# Altium project EDR_LIPO.PrjPcb
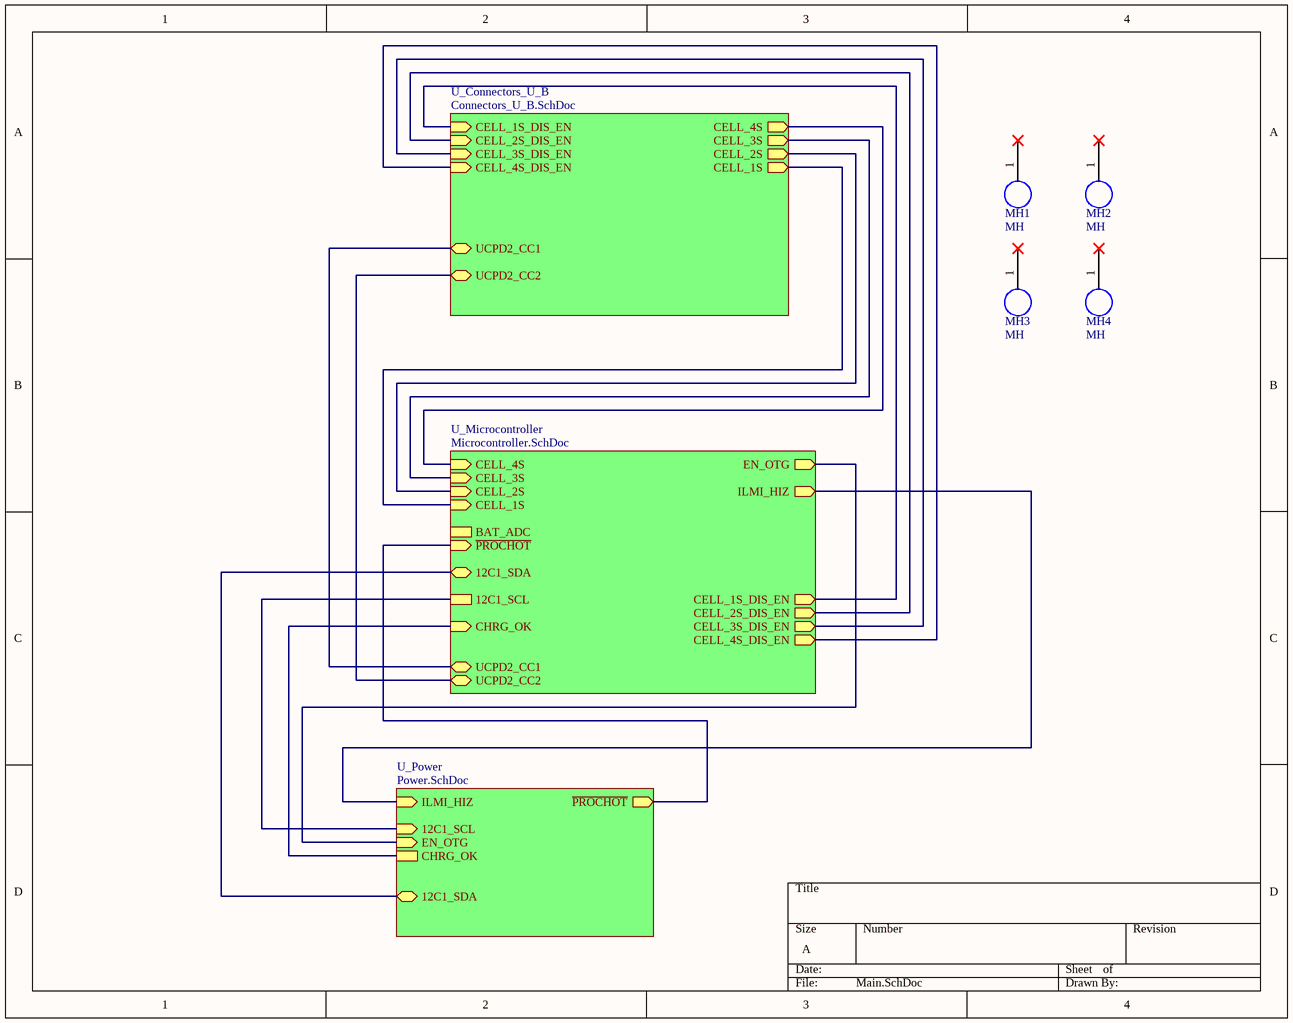
[diagram p0: Main.SchDoc]
2 sheets, 70 parts. Net scope: hierarchical (ports join the sheet entries above them; power ports are global).
Board file: Main_conection.PcbDoc
Sheets:
  Main.SchDoc
    U_Microcontroller = Microcontroller.SchDoc

## Sheet Main.SchDoc
size A; SheetNumber: 1; SheetTotal: 4

### Parts
MH1  MH  [MH]
MH2  MH  [MH]
MH3  MH  [MH]
MH4  MH  [MH]

### Sub-sheets
U_Connectors_U_B = Connectors_U_B.SchDoc (file not in this document): CELL_4S (out), CELL_3S (out), CELL_2S (out), CELL_1S (out), CELL_1S_DIS_EN (in), CELL_2S_DIS_EN (in), CELL_3S_DIS_EN (in), CELL_4S_DIS_EN (in), UCPD2_CC1 (bidir), UCPD2_CC2 (bidir)
U_Microcontroller = Microcontroller.SchDoc: BAT_ADC, CELL_4S (in), CELL_3S (in), CELL_2S (in), CELL_1S (in), EN_OTG (out), ~{PROCHOT} (in), CELL_3S_DIS_EN (out), CELL_4S_DIS_EN (out), ILMI_HIZ (out), CELL_2S_DIS_EN (out), CELL_1S_DIS_EN (out), 12C1_SDA (bidir), 12C1_SCL, CHRG_OK (in), UCPD2_CC1 (bidir), UCPD2_CC2 (bidir)
U_Power = Power.SchDoc (file not in this document): ILMI_HIZ (in), ~{PROCHOT} (out), 12C1_SDA (bidir), 12C1_SCL (in), EN_OTG (in), CHRG_OK

### Nets
12C1_SCL: sheet U_Microcontroller/12C1_SCL, sheet U_Power/12C1_SCL
12C1_SDA: sheet U_Microcontroller/12C1_SDA, sheet U_Power/12C1_SDA
CELL_1S_DIS_EN: sheet U_Connectors_U_B/CELL_1S_DIS_EN, sheet U_Microcontroller/CELL_1S_DIS_EN
CELL_2S_DIS_EN: sheet U_Connectors_U_B/CELL_2S_DIS_EN, sheet U_Microcontroller/CELL_2S_DIS_EN
CELL_3S_DIS_EN: sheet U_Connectors_U_B/CELL_3S_DIS_EN, sheet U_Microcontroller/CELL_3S_DIS_EN
CELL_4S_DIS_EN: sheet U_Connectors_U_B/CELL_4S_DIS_EN, sheet U_Microcontroller/CELL_4S_DIS_EN
UCPD2_CC1: sheet U_Connectors_U_B/UCPD2_CC1, sheet U_Microcontroller/UCPD2_CC1
UCPD2_CC2: sheet U_Connectors_U_B/UCPD2_CC2, sheet U_Microcontroller/UCPD2_CC2
NetR36_2: sheet U_Connectors_U_B/CELL_4S, sheet U_Microcontroller/CELL_4S
NetR37_2: sheet U_Connectors_U_B/CELL_2S, sheet U_Microcontroller/CELL_2S
NetR38_2: sheet U_Connectors_U_B/CELL_3S, sheet U_Microcontroller/CELL_3S
NetR39_2: sheet U_Connectors_U_B/CELL_1S, sheet U_Microcontroller/CELL_1S
NetU3_19: sheet U_Microcontroller/EN_OTG, sheet U_Power/EN_OTG
NetU3_20: sheet U_Microcontroller/~{PROCHOT}, sheet U_Power/~{PROCHOT}
NetU3_23: sheet U_Microcontroller/ILMI_HIZ, sheet U_Power/ILMI_HIZ
NetU3_24: sheet U_Microcontroller/CHRG_OK, sheet U_Power/CHRG_OK

Not connected (* = marked no-connect by the designer): MH1 1*; MH2 1*; MH3 1*; MH4 1*

## Sheet Microcontroller.SchDoc
size A; SheetNumber: 4; SheetTotal: 4
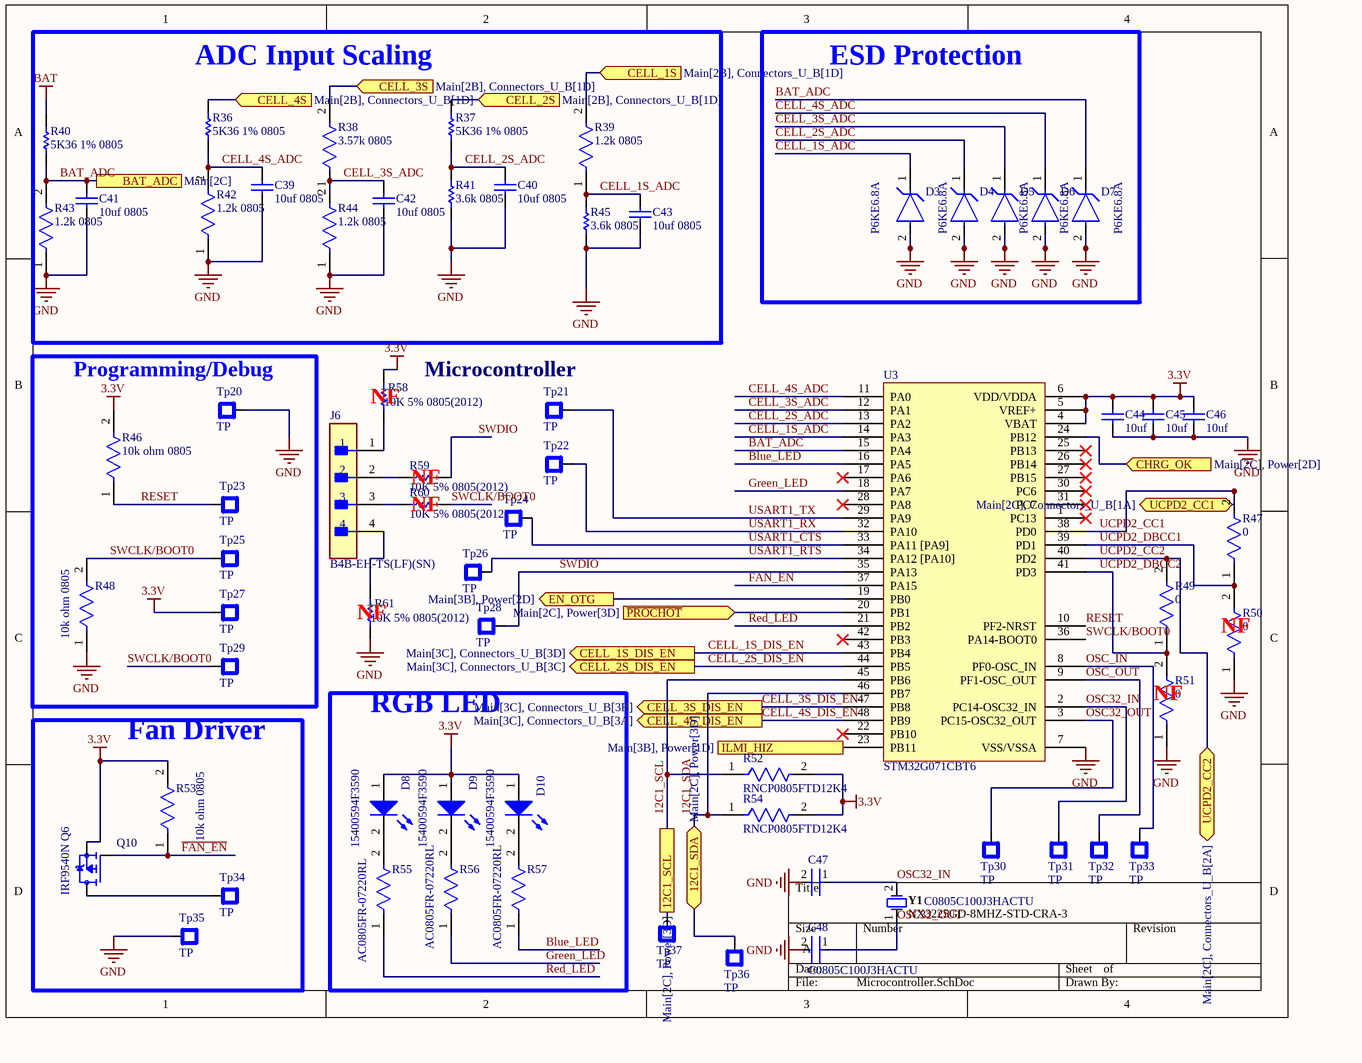
[diagram p1: Microcontroller.SchDoc]

### Parts
C39  10uf 0805  [CAPC2013X145X50NL20T20]
C40  10uf 0805  [CAPC2013X145X50NL20T20]
C41  10uf 0805  [CAPC2013X145X50NL20T20]
C42  10uf 0805  [CAPC2013X145X50NL20T20]
C43  10uf 0805  [CAPC2013X145X50NL20T20]
C44  10uf  [CAPC2013X145X50LL20T25]
C45  10uf  [CAPC2013X145X50LL20T25]
C46  10uf  [CAPC2013X145X50LL20T25]
C47  C0805C100J3HACTU  [FP-C0805C-DN-MFG]
C48  C0805C100J3HACTU  [FP-C0805C-DN-MFG]
D3  P6KE6.8A  [FP-P6KE-MFG]
D4  P6KE6.8A  [FP-P6KE-MFG]
D5  P6KE6.8A  [FP-P6KE-MFG]
D6  P6KE6.8A  [FP-P6KE-MFG]
D7  P6KE6.8A  [FP-P6KE-MFG]
D8  15400594F3590  [WL-TIRC_5mm]
D9  15400594F3590  [WL-TIRC_5mm]
D10  15400594F3590  [WL-TIRC_5mm]
J6  B4B-EH-TS(LF)(SN)  [FP-B4B-EH-TS_LF_SN-MFG]
Q10  IRF9540N Q6  [TO254P1041X444X1930-3]
R36  5K36 1% 0805  [RESC0805(2012)_M]
R37  5K36 1% 0805  [RESC0805(2012)_M]
R38  3.57k 0805  [FP-RT0805-MFG]
R39  1.2k 0805  [FP-RMCF0805-IPC_A]
R40  5K36 1% 0805  [RESC0805(2012)_M]
R41  3.6k 0805  [RESC0805(2012)_L]
R42  1.2k 0805  [FP-RMCF0805-IPC_A]
R43  1.2k 0805  [FP-RMCF0805-IPC_A]
R44  1.2k 0805  [FP-RMCF0805-IPC_A]
R45  3.6k 0805  [RESC0805(2012)_L]
R46  10k ohm 0805  [FP-MCU0805-IPC_C]
R47  0  [FP-HCJ0805-MFG]
R48  10k ohm 0805  [FP-MCU0805-IPC_C]
R49  0  [FP-HCJ0805-MFG]
R50  0  [FP-HCJ0805-MFG]
R51  0  [FP-HCJ0805-MFG]
R52  RNCP0805FTD12K4  [FP-RNCP0805-IPC_C]
R53  10k ohm 0805  [FP-MCU0805-IPC_C]
R54  RNCP0805FTD12K4  [FP-RNCP0805-IPC_C]
R55  AC0805FR-07220RL  [FP-AC0805-MFG]
R56  AC0805FR-07220RL  [FP-AC0805-MFG]
R57  AC0805FR-07220RL  [FP-AC0805-MFG]
R58  10K 5% 0805(2012)  [RESC0805(2012)_L]
R59  10K 5% 0805(2012)  [RESC0805(2012)_L]
R60  10K 5% 0805(2012)  [RESC0805(2012)_L]
R61  10K 5% 0805(2012)  [RESC0805(2012)_L]
Tp20  TP  [Tp]
Tp21  TP  [Tp]
Tp22  TP  [Tp]
Tp23  TP  [Tp]
Tp24  TP  [Tp]
Tp25  TP  [Tp]
Tp26  TP  [Tp]
Tp27  TP  [Tp]
Tp28  TP  [Tp]
Tp29  TP  [Tp]
Tp30  TP  [Tp]
Tp31  TP  [Tp]
Tp32  TP  [Tp]
Tp33  TP  [Tp]
Tp34  TP  [Tp]
Tp35  TP  [Tp]
Tp36  TP  [Tp]
Tp37  TP  [Tp]
U3  STM32G071CBT6  [QFP50P900X900X160-48N]
Y1  NX3225GD-8MHZ-STD-CRA-3  [NDK-NX3225GD-8MHZ-STD-CRA-3_V]

### Blocks framed on the sheet
ADC Input Scaling: C39-C43 R36-R45
ESD Protection: D3-D7
Programming/Debug: R46 R48 Tp20 Tp23 Tp25 Tp27 Tp29
Fan Driver: Q10 R53 Tp34 Tp35
RGB LED: D8-D10 R55-R57

### Ports
12C1_SCL (see Main[2C], Power[3D]), 12C1_SDA (bidir, see Main[2C], Power[3D]), BAT_ADC (see Main[2C]), CELL_1S (in, see Main[2B], Connectors_U_B[1D]), CELL_1S_DIS_EN (out, see Main[3C], Connectors_U_B[3D]), CELL_2S (in, see Main[2B], Connectors_U_B[1D]), CELL_2S_DIS_EN (out, see Main[3C], Connectors_U_B[3C]), CELL_3S (in, see Main[2B], Connectors_U_B[1D]), CELL_3S_DIS_EN (out, see Main[3C], Connectors_U_B[3B]), CELL_4S (in, see Main[2B], Connectors_U_B[1D]), CELL_4S_DIS_EN (out, see Main[3C], Connectors_U_B[3A]), CHRG_OK (in, see Main[2C], Power[2D]), EN_OTG (out, see Main[3B], Power[2D]), ILMI_HIZ (out, see Main[3B], Power[1D]), UCPD2_CC1 (bidir, see Main[2C], Connectors_U_B[1A]), UCPD2_CC2 (bidir, see Main[2C], Connectors_U_B[2A]), ~{PROCHOT} (in, see Main[2C], Power[3D])

### Nets
3.3V: C44.2 C45.2 C46.2 D8.1(A) D9.1(A) D10.1(A) Q10.3(S) R46.2 R52.2 R53.2 R54.2 R58.2 Tp27.1 U3.4(VBAT) U3.5(VREF+) U3.6(VDD/VDDA)
BAT: R40.2
GND: C39.1 C40.1 C41.1 C42.1 C43.1 C44.1 C45.1 C46.1 C47.2 C48.2 D3.2(A) D4.2(A) D5.2(A) D6.2(A) D7.2(A) R41.1 R42.1 R43.1 R44.1 R45.1 R48.1 R50.1 R51.1 R61.1 Tp20.1 Tp35.1 U3.7(VSS/VSSA)
12C1_SCL: R52.1 Tp37.1 U3.45(PB6) ; port 12C1_SCL
12C1_SDA: R54.1 Tp36.1 U3.46(PB7) ; port 12C1_SDA
BAT_ADC: C41.2 D7.1(C) R40.1 R43.2 U3.15(PA4) ; port BAT_ADC
Blue_LED: R57.1 U3.16(PA5)
CELL_1S_ADC: C43.2 D3.1(C) R39.1 R45.2 U3.14(PA3)
CELL_1S_DIS_EN: U3.43(PB4) ; port CELL_1S_DIS_EN
CELL_2S_ADC: C40.2 D4.1(C) R37.1 R41.2 U3.13(PA2)
CELL_2S_DIS_EN: U3.44(PB5) ; port CELL_2S_DIS_EN
CELL_3S_ADC: C42.2 D5.1(C) R38.1 R44.2 U3.12(PA1)
CELL_3S_DIS_EN: U3.47(PB8) ; port CELL_3S_DIS_EN
CELL_4S_ADC: C39.2 D6.1(C) R36.1 R42.2 U3.11(PA0)
CELL_4S_DIS_EN: U3.48(PB9) ; port CELL_4S_DIS_EN
~{FAN_EN}: Q10.1(G) R53.1 U3.37(PA15)
Green_LED: R56.1 U3.18(PA7)
OSC32_IN: C47.1 Tp31.1 U3.2(PC14-OSC32_IN) Y1.2
OSC32_OUT: C48.1 Tp30.1 U3.3(PC15-OSC32_OUT) Y1.1
OSC_IN: Tp33.1 U3.8(PF0-OSC_IN)
OSC_OUT: Tp32.1 U3.9(PF1-OSC_OUT)
Red_LED: R55.1 U3.21(PB2)
RESET: R46.1 Tp23.1 U3.10(PF2-NRST)
SWCLK/BOOT0: R48.2 R60.2 Tp25.1 Tp29.1 U3.36(PA14-BOOT0)
SWDIO: R59.2 Tp28.1 U3.35(PA13)
UCPD2_CC1: R47.2 U3.38(PD0) ; port UCPD2_CC1
UCPD2_CC2: R49.2 U3.40(PD2) ; port UCPD2_CC2
UCPD2_DBCC1: R47.1 R50.2 U3.39(PD1)
UCPD2_DBCC2: R49.1 R51.2 U3.41(PD3)
USART1_CTS: Tp24.1 U3.33(PA11_[PA9])
USART1_RTS: Tp26.1 U3.34(PA12_[PA10])
USART1_RX: Tp22.1 U3.32(PA10)
USART1_TX: Tp21.1 U3.29(PA9)
NetD8_2: D8.2(K) R55.2
NetD9_2: D9.2(K) R56.2
NetD10_2: D10.2(K) R57.2
NetJ6_1: J6.1 R58.1
NetJ6_2: J6.2 R59.1
NetJ6_3: J6.3 R60.1
NetJ6_4: J6.4 R61.2
NetQ10_2: Q10.2(D) Tp34.1
NetR36_2: R36.2 ; port CELL_4S
NetR37_2: R37.2 ; port CELL_2S
NetR38_2: R38.2 ; port CELL_3S
NetR39_2: R39.2 ; port CELL_1S
NetU3_19: U3.19(PB0) ; port EN_OTG
NetU3_20: U3.20(PB1) ; port ~{PROCHOT}
NetU3_23: U3.23(PB11) ; port ILMI_HIZ
NetU3_24: U3.24(PB12) ; port CHRG_OK

Not connected (* = marked no-connect by the designer): U3 1(PC13)* 17(PA6)* 22(PB10)* 25(PB13)* 26(PB14)* 27(PB15)* 28(PA8)* 30(PC6)* 31(PC7)* 42(PB3)*

### Notes on the sheet
- (near R58) NF
- Microcontroller
- (near R59) NF
- (near R60) NF
- (near R61) NF
- (near R50) NF
- (near R51) NF

### Library data of the parts
C39-C43 = CMP-2007-01676-1: Part Number: VJ0805Y105KXQRW1BC; Manufacturer: Vitramon
C44-C46 = CMP-2007-01044-1: Manufacturer: Kemet; Part Number: C0805C106K8RACTU
C47 C48 = CMP-03020-010976-1: C0805 10 pF X8R 30ppm/°C 5.00% 25 V; Manufacturer: KEMET; Tolerance: 0.05; Value: 10 pF; Material: Ceramic; Voltage Rating: 25 V; Manufacturer Part Number: C0805C100J3HACTU; Height: 0.88mm; Lead Free: Yes; Capacitance: 10 pF; Device Class L2: Capacitors; Category: Cap; ComponentLink2Description: Datasheet; Temperature Characteristic: X8R; Temperature Coefficient: 30ppm/°C; Device Class L3: Ceramic Capacitors; Temperature Range High: +125°C; Device Class L1: Passive Components; ComponentLink2URL: https://content.kemet.com/datasheets/KEM_C1003_C0G_SMD.pdf; Temperature Range Low: -55°C; RoHS: TRUE; Ipc Land Pattern Name: CAPC200125X78; Automotive: No; Octopart: https://octopart.com/c0805c100j3hactu-kemet-88696329; Package: C0805C-DN; Temperature: -55°C to +125°C
D3-D7 = CMP-08607-000072-1: TVS DIODE 5.8V 10.5V DO204AC; Manufacturer: Littelfuse Inc; Peak Pulse Power: 600W; Max Junction Temp: +175°C; Peak Pulse Current: 58.1A; Number Of Channels: 1; Direction: Unidirectional; Breakdown Voltage: 6.45V; Mouser Description: TVSS; Diode; For Data/Comm; Industrial Equip; 58.1A; Thru-Hole; Solder Term; Height: 3.6mm; RoHS: TRUE; Lead Free: Yes; Category: Diode; ComponentLink2Description: Datasheet; Manufacturer Part Number: P6KE6.8A; Package: P6KE; Temperature Range Low: -55°C; Device Class L3: unset; Digikey Description: TVS DIODE 5.8V 10.5V DO204AC; Temperature Range High: +175°C; Automotive: No; Clamping Voltage: 10.5V; Ipc Land Pattern Name: DIOPA1328W105L760D360; Octopart: https://octopart.com/p6ke6.8a-littelfuse-20808; ComponentLink2URL: https://www.littelfuse.com/~/media/electronics/datasheets/tvs_diodes/littelfuse_tvs_diode_p6ke_datasheet.pdf.pdf; Temperature: -55°C to +175°C; Device Class L2: TVS Diodes; Device Class L1: Circuit Protection; Reverse Standoff Voltage: 5.8V
D8-D10 = CMP-03913-110288041-2: Led, 5Mm, 940Nm, 30Mw/Sr, Th Rohs Compliant: Yes; Forward Voltage: 1.3V; Viewing Angle: 30°; Forward Current: 1A; Max Reverse Voltage (DC): 5V; RoHS: Compliant; Peak Wavelength: 940nm; Max Operating Temperature: 85°C; Min Operating Temperature: -40°C
J6 = CMP-17439-000699-1: CONN HEADER EH TOP 4POS 2.5MM; Number of Positions: 4; Case/Package: Radial; Pitch: 2.5mm; Lead Free: Lead Free; Termination: Crimp
Q10 = IRF9540N Q6: P-Channel 100 V 23A (Tc) 3.1W (Ta), 110W (Tc); MF: Infineon Technologies; Value: *; Purchase-URL: https://pricing.snapeda.com/search/part/IRF9540N/?ref=eda; Package: TO-220 Infineon; MP: IRF9540N; Check_prices: https://www.snapeda.com/parts/IRF9540N/Infineon+Technologies/view-part/?ref=eda; SnapEDA_Link: https://www.snapeda.com/parts/IRF9540N/Infineon+Technologies/view-part/?ref=snap; Price: None; Availability: In Stock
R36 R37 R40 = CMP-1013-00593-1: 5K36 0.125W 1% 0805 (2012 Metric)  SMD; Value: 5360.00 Ohm; Case-Metric: 2012; Case-EIA: 0805; Power: 0.125 W; Tolerance: 1 %; Technology: SMT
R38 = CMP-03412-012413-1: RES 357K OHM 1/8W .1% SMD 0805; Manufacturer: Yageo; Manufacturer Part Number: RT0805BRD07357KL; Temperature Coefficient: 25 ppm/°C; Voltage Rating: 150V; Value: 357KΩ; Power Rating: 0.125W; Tolerance: 0.0025; Automotive: No; Octopart: https://octopart.com/rt0805brd07357kl-yageo-1483813; Package: RT0805; Ipc Land Pattern Name: RESC200125X50; ComponentLink2Description: Datasheet; Series: RT; ComponentLink2URL: http://www.yageo.com/documents/recent/PYu-RT_1-to-0.01_RoHS_L_9.pdf; Device Class L1: Passive Components; Height: 0.6mm; Digikey Description: RES 357K OHM 1/8W .1% SMD 0805; Category: Res; Lead Free: Yes; Temperature: -55°C to +155°C; Composition: Thin Film; Mouser Description: Thin Film Resistors - SMD 1/8W 357K ohm .1% 25ppm; Device Class L2: Resistors; RoHS: TRUE; Temperature Range High: +155°C; Device Class L3: Chip SMD Resistors; Resistance: 357KΩ; Footprint Url: http://www.yageo.com/exep/pages/download/literatures/PYu-R_Mount_10.pdf; Temperature Range Low: -55°C
R39 R42-R44 = CMP-26527-005543-1: 1.2kΩ ±5% 0.125W 0805 Thick Film Chip Resistor AEC-Q200 compliant; Resistance: 1.2kR; Temperature Coefficient: 200ppm/°C; Max Power Dissipation: 125mW; RoHS Compliant: Yes; Width: 0.049inch; Max Operating Temperature: 155°C; Features: Automotive AEC-Q200; Contact Plating: Tin; Series: RMCF; Height: 0.026inch; Radiation Hardening: No; Packaging: Tape and Reel; Number of Terminations: 2; Length: 0.079inch; Min Operating Temperature: -55°C; Resistor Type: Thick Film; Case/Package: 0805; Tolerance: 5%; Mount: Surface Mount
R41 R45 = CMP-1013-00087-1: 3K6 0.125W 5% 0805 (2012 Metric)  SMD; Case-Metric: 2012; Value: 3600.00 Ohm; Case-EIA: 0805; Technology: SMT; Tolerance: 5 %; Power: 0.125 W
R46 R48 R53 = CMP-02407-000241-1: RES 1.05K OHM 0.5% 1/5W 0805; Power Rating: 200mW; Tolerance: 0.1%; Voltage Rating: 150V; Resistance: 10kR; Height: 0.52mm; Min Operating Temperature: -55°C; Packaging: Tape and Reel; Case Code (Imperial): 0805; Case/Package: 0805; Case Code (Metric): 2012; Weight: 0.000162oz; Width: 1.25mm; Length: 2mm; Max Operating Temperature: 155°C; Composition: Thin Film
R47 R49-R51 = CMP-26527-000104-1: RES 0 OHM JUMPER 1/2W 0805; Resistance: 0mR; Radiation Hardening: No; Case Code (Imperial): 0805; Number of Terminations: 2; Lead Free: Lead Free; Max Operating Temperature: 155°C; Width: 0.049inch; Case Code (Metric): 2012; Height: 0.026inch; Mount: Surface Mount; Min Operating Temperature: -55°C; Packaging: Tape and Reel; Package Quantity: 1; Termination: Wraparound; Length: 0.079inch; RoHS Compliant: Yes; Case/Package: 0805
R52 R54 = CMP-26527-001038-1: 12.4kΩ ±1% 0.25W 0805 High Power Anti-Sulfur Thin Film Chip Resistor; Temperature Coefficient: 100ppm/°C; Max Power Dissipation: 250mW; Resistance: 12.4kR; Height: 0.024inch; Resistor Type: Thin Film; Width: 0.049inch; Case/Package: 0805; Series: RNCP; Min Operating Temperature: -55°C; Case Code (Metric): 2012; Packaging: Tape and Reel; Case Code (Imperial): 0805; Tolerance: 1%; RoHS Compliant: Yes; Max Operating Temperature: 155°C; Number of Terminations: 2; Features: Moisture Resistant; Length: 0.079inch; Mount: Surface Mount
R55-R57 = CMP-2001-04488-2: RES SMD 220 OHM 1% 1/8W 0805; Manufacturer: Yageo; Value: 220Ω; Tolerance: 0.01; Voltage Rating: 150V; Automotive Grade: Grade 0; Automotive: Yes; Composition: Thick Film; Lead Free: Yes; Octopart: https://octopart.com/ac0805fr-07220rl-yageo-26041145; Series: AC; Device Class L1: Passive Components; Temperature: -55°C to +155°C; Device Class L3: Chip SMD Resistors; Package: AC0805; Digikey Description: RES SMD 220 OHM 1% 1/8W 0805; ComponentLink2URL: http://www.yageo.com/documents/recent/PYu-AC_51_RoHS_L_6.pdf; ComponentLink2Description: Datasheet; Resistance: 220Ω; Mouser Description: Thick Film Resistors - SMD 1/8W 220ohm 1% AEC-Q200; Ipc Land Pattern Name: RESC200125X50; Power Rating: 1/8W; Device Class L2: Resistors; Category: Res; Footprint Url: http://www.yageo.com/exep/pages/download/literatures/PYu-R_Mount_10.pdf; Manufacturer Part Number: AC0805FR-07220RL; Temperature Range Low: -55°C; Height: 0.6mm; Temperature Range High: +155°C; RoHS: TRUE
R58-R61 = CMP-1013-00098-1: 10K 0.125W 5% 0805 (2012 Metric)  SMD; Case-EIA: 0805; Case-Metric: 2012; Value: 10000.00 Ohm; Power: 0.125 W; Technology: SMT; Tolerance: 5 %
U3 = STM32G071CBT6: MCU 32-bit ARM Cortex M0+ RISC 128KB Flash 1.8V/2.5V/3.3V 48-Pin LQFP Tray; Manufacturer: STMicroelectronics; ADC Channels (Resolution): 14-Ch 12-Bit; Core Architecture: ARM Cortex-M0+; DAC Channels (Resolution): 2-Ch 12-Bit; Data Bus Width: 32b; EEPROM Memory Size: 0B; Frequency: 64MHz; Interface: I2S; Clock Frequency: 48MHz; Max Junction Temperature (Tj): 105°C; Max Supply Current: 7mA; Max Supply Voltage: 3.6V; Min Supply Voltage: 1.7V; Number of A/D Converters: 1; Number of ADC Channels: 17; Number of Channels: 14; Number of D/A Converters: 2; Number of I/Os: 5; Number of Interrupts: 44; Number of Timers/Counters: 12; Number of UART Channels: 0; Number of USART Channels: 4; Operating Supply Voltage: 1.8V; Peripherals: POR, PWM, WDT; RAM Size: 36kB; Supplier: Avnet; Supplier Part Number: 84AC2899; Manufacturer Part Number: STM32G071CBT6; RoHS: Compliant; Category: Microcontrollers; Stock: 1757; Pricing: 1=3.97, 10=3.29, 25=3.08, 50=2.97, 100=2.86, 250=2.76, 500=2.69 (USD); Ambient Temperature Range High: 85°C; Case/Package: LFQFP; China RoHS: Compliant; Country of Origin: Mainland China; Export Control Classification Number (ECCN) Code: 3A991.A.2; Flash Memory Size: 128kB; Height: 1.6mm; Height - Seated (Max): 1.6mm; Harmonized Tariff Schedule (HTS) Code: 8542.31.00.25; Introduction Date: 2019-03-07; Length: 7mm; Lifecycle Status: Production; Max Operating Temperature: 85°C; Memory Size: 128kB; Memory Format: FLASH; Min Operating Temperature: -40°C; Number of I2C Channels: 2; Number of SPI Channels: 2; Number of Terminals: 48; Number of USB Channels: 2; REACH SVHC: Yes; Schedule B: 8542310000, 8542310000|8542310000, 8542310000|8542310000|8542310000|8542310000|8542310000; Terminal Pitch: 500µm; Width: 7mm; ComponentLink1URL: https://datasheet.octopart.com:443/STM32G071CBT6-STMicroelectronics-datasheet-159144893.pdf?src-supplier=IHS; ComponentLink1Description: https://datasheet.octopart.com:443/STM32G071CBT6-STMicroelectronics-datasheet-159144893.pdf?src-supplier=IHS; ComponentLink2URL: https://datasheet.octopart.com:443/STM32G071CBT6-STMicroelectronics-datasheet-132344621.pdf?src-supplier=ODG+(Origin+Data+Global); ComponentLink2Description: https://datasheet.octopart.com:443/STM32G071CBT6-STMicroelectronics-datasheet-132344621.pdf?src-supplier=ODG+(Origin+Data+Global); ComponentLink3URL: https://datasheet.octopart.com:443/STM32G071CBT6-STMicroelectronics-datasheet-130125765.pdf?src-supplier=element14+APAC; ComponentLink3Description: https://datasheet.octopart.com:443/STM32G071CBT6-STMicroelectronics-datasheet-130125765.pdf?src-supplier=element14+APAC
Y1 = CMP-2000-07595-1: Crystal Unit, 8 MHz, 8 pF, -40 to 150 degC, 2-Pin SMD, RoHS, Tape and Reel; Manufacturer: NDK; Load Capacitance: 8pF; ESR (Equivalent Series Resistance): 500Ohm; Frequency Tolerance: 50ppm; Frequency Stability: 150ppm; Frequency: 8MHz; Case/Package: SMD/SMT; Datasheet Version: 11/2016; Min Operating Temperature: -40degC; Packaging: TapeandReel; Width: 0.098inch; Package Quantity: 3000; Number of Pins: 2; Package Description: 2-Pin Surface Mount Device, Body 3.2 x 2.5 mm; RoHSCompliant: True; Package Reference: NX3225GD-8MHZ-STD-CRA-3; Datasheet URL: http://www.ndk.com/images/products/catalog/c_NX3225GD-STD-CRA-3_e.pdf; Mounting Technology: SurfaceMount; Length: 0.126inch; Mount: SurfaceMount; Manufacturer URL: http://www.ndk.com/en/; Max Operating Temperature: 150degC; Height: 0.039inch